# Altium schematic sheet Peripherals.SchDoc: SmartCoin
size A4; Date: 22.06.2025; Author: Vamsi Krishna Sesham; Revision: A; SheetNumber: 4; SheetTotal: 5
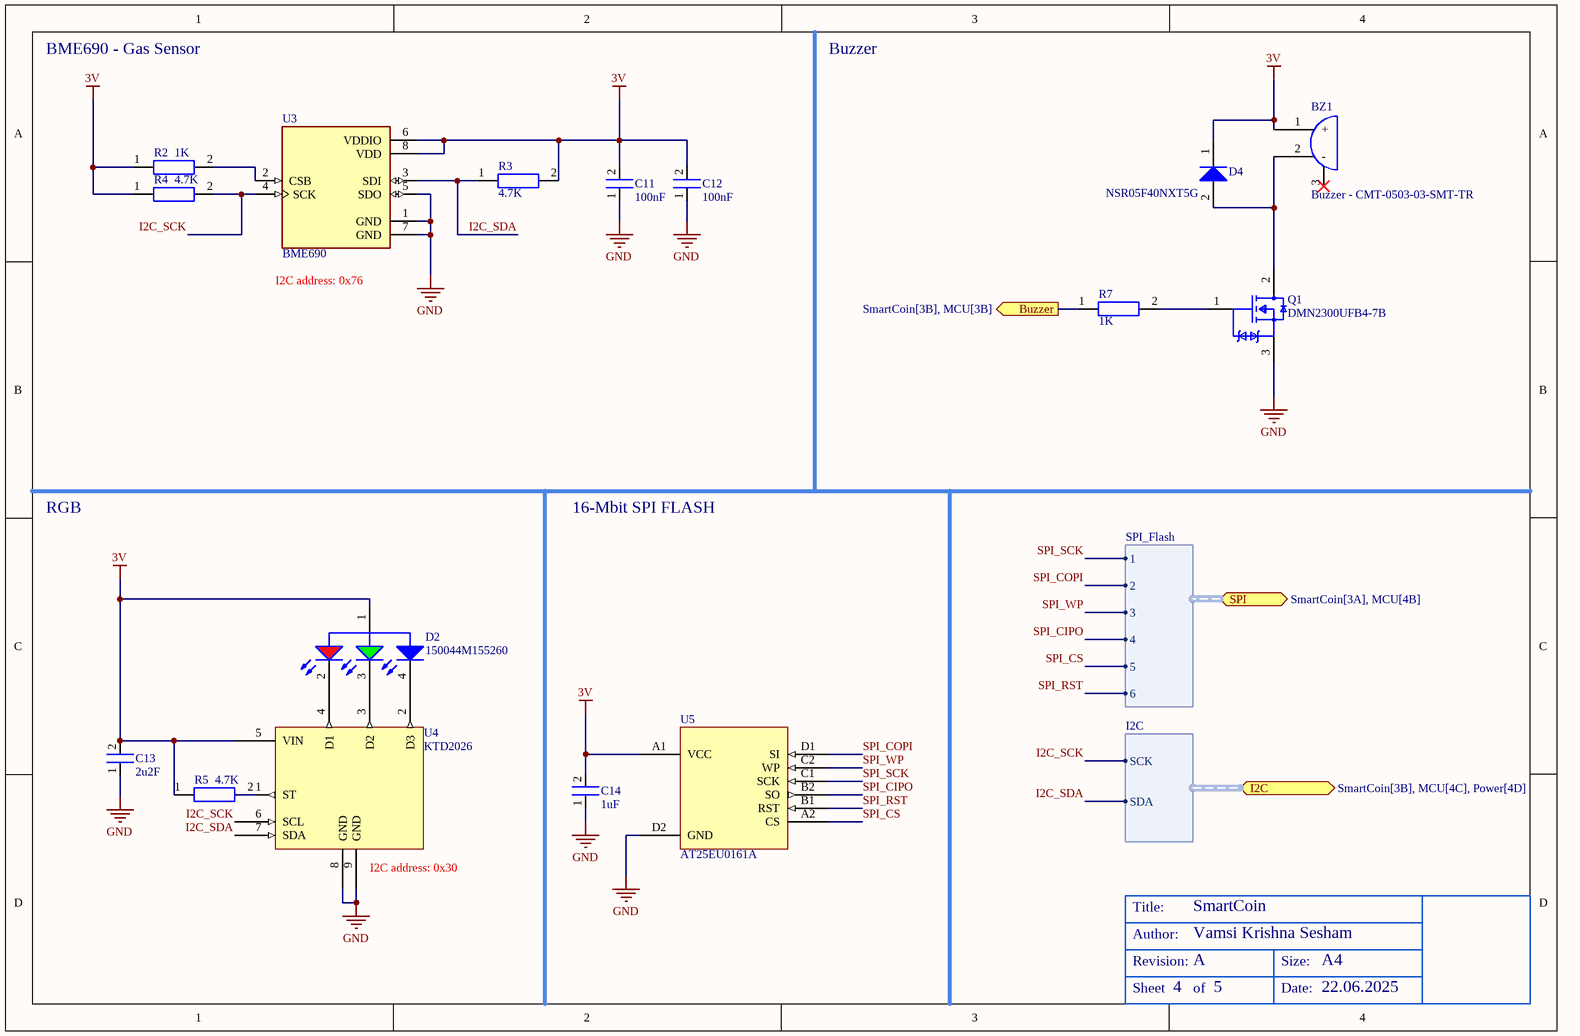
[diagram p0: Peripherals.SchDoc]

## Parts
*  TitleBlock  (value not drawn)  (graphical)
BZ1  Buzzer - CMT-0503-03-SMT-TR  [Buzzer - CMT-0503-03-SMT-TR]
C11  100nF  [Capacitor - 0201]
C12  100nF  [Capacitor - 0201]
C13  2u2F  [Capacitor - 0201]
C14  1uF  [Capacitor - 0201]
D2  150044M155260  [WL-SFCC_0404_150044M155260]
D4  NSR05F40NXT5G  [ONSC-DSN-2-152AC-01_V]
Q1  DMN2300UFB4-7B  [FP-X2-DFN1006-3-MFG]
R2  1K  [Resistor - 0201]
R3  4.7K  [Resistor - 0201]
R4  4.7K  [Resistor - 0201]
R5  4.7K  [Resistor - 0201]
R7  1K  [Resistor - 0201]
U3  BME690  [IC_BME688]
U4  KTD2026  [KTD2026]
U5  AT25EU0161A  [AT25EU0161A]

## Ports
Buzzer (out, see SmartCoin[3B], MCU[3B]), I2C (bidir, harness I2C, see SmartCoin[3B], MCU[4C], Power[4D]), SPI (bidir, harness SPI_Flash, see SmartCoin[3A], MCU[4B])

## Harnesses
I2C: SCK, SDA
SPI_Flash: 1, 2, 3, 4, 5, 6

## Nets
3V: BZ1.1(+) C11.2 C12.2 C13.2 C14.2 D2.1(A) D4.1(K) R2.1 R3.2 R4.1 R5.1 U3.6(VDDIO) U3.8(VDD) U4.5(VIN) U5.A1(VCC)
GND: C11.1 C12.1 C13.1 C14.1 Q1.3(S) U3.1(GND) U3.5(SDO) U3.7(GND) U4.8(GND) U4.9(GND) U5.D2(GND)
Buzzer: R7.1 ; port Buzzer
I2C_SCK: R4.2 U3.4(SCK) U4.6(SCL) ; port I2C.SCK
I2C_SDA: R3.1 U3.3(SDI) U4.7(SDA) ; port I2C.SDA
SPI_CIPO: U5.B2(SO) ; port SPI.4
SPI_COPI: U5.D1(SI) ; port SPI.2
SPI_CS: U5.A2(CS) ; port SPI.5
SPI_RST: U5.B1(RST) ; port SPI.6
SPI_SCK: U5.C1(SCK) ; port SPI.1
SPI_WP: U5.C2(WP) ; port SPI.3
NetBZ1_2: BZ1.2(-) D4.2(A) Q1.2(D)
NetD2_2: D2.2(K) U4.4(D1)
NetD2_3: D2.3(K) U4.3(D2)
NetD2_4: D2.4(K) U4.2(D3)
NetQ1_1: Q1.1(G) R7.2
NetR2_2: R2.2 U3.2(CSB)
NetR5_2: R5.2 U4.1(ST)

Not connected (* = marked no-connect by the designer): BZ1 3*

## Notes on the sheet
- BME690 - Gas Sensor
- Buzzer
- (near U3) I2C address: 0x76
- RGB
- 16-Mbit SPI FLASH
- (near U4) I2C address: 0x30
- (in symbol TitleBlock) Title:; Author:; Revision:; Size:; A4; Sheet; of; Date:

## Library data of the parts
BZ1 = Buzzer - CMT-0503-03-SMT-TR: MAGNETIC BUZZER TRANSDUCER
C11-C14 = Capacitor - 0201
D2 = CMP-03913-98750578-1: 150044M155260 WL-SFCC SMT Full-color Chip LED compact; Color: Blue, Green, Red; Power Dissipation: 24mW; Reverse Voltage: 5V; Dominant Wavelength: 530nm; Forward Voltage: 2V; Luminous Intensity: 50mcd; Forward Current: 30mA; Peak Wavelength: 465nm; Viewing Angle: 140°; NexarPartId: 98750578; Max Operating Temperature: 85°C; Width: 1mm; Case/Package: 0404; Min Operating Temperature: -40°C; Max Reverse Voltage (DC): 5V; RoHS: Compliant; Length: 1mm; Height: 650µm
D4 = CMP-1055-00232-1: Schottky Barrier Diode, 2-Pin DSN, Pb-Free, Tape and Reel; Manufacturer: On Semiconductor; IFSM Max (A): 10; Configuration: Single; RoHS: TRUE; PackageVersion: Rev. C, 01/2011; ComponentLink3Description: Package Specification; ComponentLink3URL: http://www.onsemi.cn/pub_link/Collateral/152AC.PDF; PackageDescription: 2-Pin Micro Molded Package, Body 1 x 0.6 mm; ComponentLink1URL: http://www.onsemi.com/; ComponentLink1Description: Manufacturer URL; Mounting Technology: Surface Mount; Packing: Tape and Reel; PackageReference: DSN-2-152AC-01; ComponentLink2Description: Datasheet; DatasheetVersion: Rev. 3; ComponentLink2URL: http://www.onsemi.cn/pub_link/Collateral/NSR05F40.PDF; PartNumber: NSR05F40NXT5G
Q1 = CMP-12801-000056-1: MOSFET N-CH 20V 1.3A 3DFN; Manufacturer: Diodes Inc.; Rthja Max: 250°C/W; Standoff Height: 0mm; Turn On Delay Time: 3.5ns; Depletion Mode: False; Number Of N Channels: 1; Max Junction Temp: +150°C; Threshold Vgs Max: 0.95V; Gate To Source Voltage: 8V; Input Capacitace At Vds: 67.6pF @ 20V; Power Dissipation: 500mW; Max Forward Diode Voltage: 1.2V; Pulse Drain Current: 6A; Gate Charge At Vgs: 1.6nC @ 4.5V; Threshold Vgs Min: 0.45V; Drain To Source Resistance: 175mΩ; Turn Off Delay Time: 38ns; Typ Forward Diode Voltage: 0.7V; Category: Trans; Lead Free: Yes; Octopart: https://octopart.com/dmn2300ufb4-7b-diodes+inc.-21789371; RoHS: TRUE; Drain To Source Breakdown Voltage: 20V; ComponentLink2Description: Datasheet; Drain To Source Voltage: 20V; ComponentLink2URL: https://www.diodes.com/assets/Datasheets/DMN2300UFB4.pdf; Automotive: No; Height: 0.4mm; Temperature Range High: +150°C; Package: X2-DFN1006-3; Mouser Description: MOSFET 20V N-Ch ENH Mode 175mOhm 4.5V 1.30A; Digikey Description: MOSFET N-CH 20V 1.3A 3DFN; Footprint Url: https://www.diodes.com/assets/Package-Files/X2-DFN1006-3.pdf; Device Class L1: Discrete Semiconductors; Temperature Range Low: -55°C; Number Of Channels: 1; Device Class L3: MOSFETs; Device Class L2: Transistors; Manufacturer Part Number: DMN2300UFB4-7B; Temperature: -55°C to +150°C; Continuous Drain Current: 1.3A
R2-R5 R7 = Resistor - 0201
U3 = CMP-008-000000-2: Gas sensor measuring relative humidity, barometric pressure, ambient temperature and gas (VOC); Pin Count: 8; Availability: Unavailable; Package: None; Price: None; MP: BME688; Source: BME688.SchLib; Design Item ID: BME688; Value: *; Component Type: Standard; ComponentLink1Description: New link; ComponentLink1URL: https://www.mouser.de/ProductDetail/Bosch-Sensortec/BME690?qs=%252BXxaIXUDbq38jwlEAGDF7A%3D%3D&mgh=1&vip=1&utm_id=20979042634&utm_source=google&utm_medium=cpc&utm_marketing_tactic=emeacorp&gad_source=1&gbraid=0AAAAADn_wf2GV-P32WQOtb6QF-9Q6urY0&gclid=CjwKCAjwn6LABhBSEiwAsNJrjqYGezIL6UTP-OEPoU9ondhUKEEh1LMLQiGljPd-_uXlPKwCiylmnRoC0IEQAvD_BwE
U4 = KTD2026: 3-CHANNEL Rgb Led Driver With I2C
U5 = AT25EU0161A: 16-Mbit, Ultra-Low Energy Serial Flash Memory